# Altium schematic sheet USB.SchDoc
size A4; SheetNumber: 2; SheetTotal: 3
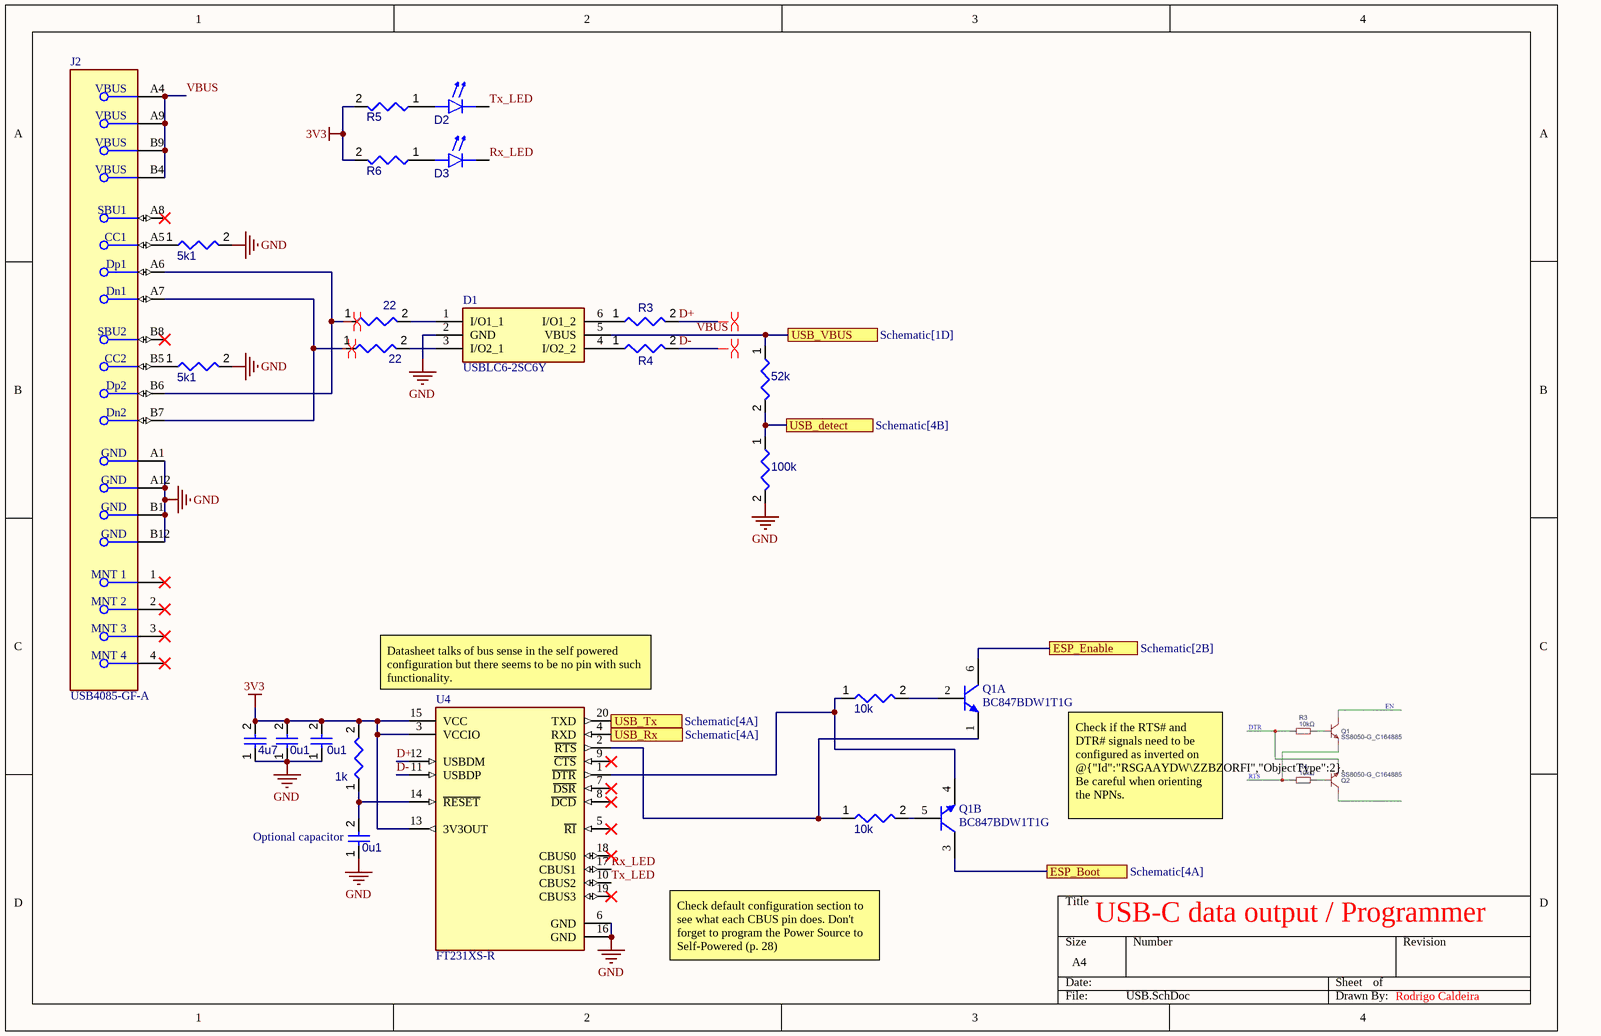
[diagram p0: USB.SchDoc]

## Parts
(Parts that share a designator on the sheet are numbered #1, #2 ... from top to bottom, then left to right.)
0u1#1  Capacitors  (value not drawn)
0u1#2  Capacitors  (value not drawn)
0u1#3  Capacitors  (value not drawn)
1k  Resistors  (value not drawn)
4u7  Capacitors  (value not drawn)
5k1#1  Resistors  (value not drawn)
5k1#2  Resistors  (value not drawn)
10k#1  Resistors  (value not drawn)
10k#2  Resistors  (value not drawn)
22#1  Resistors  (value not drawn)
22#2  Resistors  (value not drawn)
52k  Resistors  (value not drawn)
100k  Resistors  (value not drawn)
D1  USBLC6-2SC6Y  [SOT95P280X145-6N]
D2  LED  (value not drawn)
D3  LED  (value not drawn)
J2  USB4085-GF-A  [FP-USB4085-GF-A-MFG]
Q1  BC847BDW1T1G  [ONSC-SOT-363-6-419B-02_W_V]  (parts A,B of 2)
R3  Resistors  (value not drawn)
R4  Resistors  (value not drawn)
R5  Resistors  (value not drawn)
R6  Resistors  (value not drawn)
U4  FT231XS-R  [FP-SSOP-20-MFG]

## Ports
ESP_Boot (see Schematic[4A]), ESP_Enable (see Schematic[2B]), USB_detect (see Schematic[4B]), USB_Rx (see Schematic[4A]), USB_Tx (see Schematic[4A]), USB_VBUS (see Schematic[1D])

## Nets
3V3: 0u1#1.2 0u1#2.2 1k.2 4u7.2 R5.2 R6.2 U4.3(VCCIO) U4.13(3V3OUT) U4.15(VCC)
GND: 0u1#1.1 0u1#2.1 0u1#3.1 4u7.1 5k1#1.2 5k1#2.2 100k.2 D1.2(GND) J2.A1(GND) J2.A12(GND) J2.B1(GND) J2.B12(GND) U4.6(GND) U4.16(GND)
D+: R3.2 U4.12(USBDM)
D-: R4.2 U4.11(USBDP)
ESP_Boot: Q1.3(C) ; port ESP_Boot
ESP_Enable: Q1.6(C) ; port ESP_Enable
Rx_LED: D3.1(K) U4.17(CBUS1)
Tx_LED: D2.1(K) U4.10(CBUS2)
USB_detect: 52k.2 100k.1 ; port USB_detect
USB_Rx: U4.4(RXD) ; port USB_Rx
USB_Tx: U4.20(TXD) ; port USB_Tx
VBUS: 52k.1 D1.5(VBUS) J2.A4(VBUS) J2.A9(VBUS) J2.B4(VBUS) J2.B9(VBUS) ; port USB_VBUS
Net0u1#3_2: 0u1#3.2 1k.1 U4.14(~{RESET})
Net5k1#1_1: 5k1#1.1 J2.A5(CC1)
Net5k1#2_1: 5k1#2.1 J2.B5(CC2)
Net10k#1_1: 10k#1.1 Q1.4(E) U4.1(~{DTR})
Net10k#1_2: 10k#1.2 Q1.2(B)
Net10k#2_1: 10k#2.1 Q1.1(E) U4.2(~{RTS})
Net10k#2_2: 10k#2.2 Q1.5(B)
Net22#1_1: 22#1.1 J2.A6(Dp1) J2.B6(Dp2)
Net22#1_2: 22#1.2 D1.1(I/O1_1)
Net22#2_1: 22#2.1 J2.A7(Dn1) J2.B7(Dn2)
Net22#2_2: 22#2.2 D1.3(I/O2_1)
NetD1_4: D1.4(I/O2_2) R4.1
NetD1_6: D1.6(I/O1_2) R3.1
NetD2_2: D2.2(A) R5.1
NetD3_2: D3.2(A) R6.1

Not connected (* = marked no-connect by the designer): J2 1(MNT_1)* 2(MNT_2)* 3(MNT_3)* 4(MNT_4)* A8(SBU1)* B8(SBU2)*; U4 5(~{RI})* 7(~{DSR})* 8(~{DCD})* 9(~{CTS})* 18(CBUS0)* 19(CBUS3)*

## Layout directives
differential pair: D+, D-, Net22#1_1, Net22#2_1

## Notes on the sheet
- (near U4) Datasheet talks of bus sense in the self powered configuration but there seems to be no pin with such functionality.
- (near 0u1#3) Optional capacitor
- Check if the RTS# and DTR# signals need to be configured as inverted on @{"Id":"RSGAAYDW\ZZBZORFI","ObjectType":2}.
  Be careful when orienting the NPNs.
- Check default configuration section to see what each CBUS pin does. Don't forget to program the Power Source to Self-Powered (p. 28)
- USB-C data output / Programmer
- Rodrigo Caldeira

## Library data of the parts
0u1#1-0u1#3 4u7 = Capacitors: Capacitor; Component Type: Capacitors
1k 5k1#1 5k1#2 10k#1 10k#2 22#1 22#2 52k R3-R6 = Resistors: Resistor; Component Type: Resistors
D1 = USBLC6-2SC6Y: Diode; Manufacturer_Name: STMicroelectronics; Datasheet Link: https://componentsearchengine.com/Datasheets/1/USBLC6-2SC6Y.pdf; Height: 1.45mm; Manufacturer_Part_Number: USBLC6-2SC6Y; Mouser Part Number: 511-USBLC6-2SC6Y; Mouser Price/Stock: https://www.mouser.co.uk/ProductDetail/STMicroelectronics/USBLC6-2SC6Y?qs=gNDSiZmRJS%2FOgDexvXkdow%3D%3D; Arrow Part Number: USBLC6-2SC6Y; Arrow Price/Stock: https://www.arrow.com/en/products/usblc6-2sc6y/stmicroelectronics?utm_currency=USD&region=nac
D2 D3 = LED: Light-emitting Diode; Component Type: LED
J2 = CMP-196119-000001-2: CONN RCPT USB2.0 TYPE C 24POS RA; Gender: Receptacle; Number of Positions: 16; USB Standard: USB 2.0; Orientation: Right Angle; Contact Plating: Gold; Contact Material: Copper Alloy
Q1 = CMP-1048-00875-1: Dual General Purpose Transistors, NPN, 6-Pin SOT-363, Pb-Free, Tape and Reel; Manufacturer: On Semiconductor; fT Min (MHz): 100; IC Continuous (A): 0.1; Polarity: Dual NPN; ComponentLink3Description: Package Specification; PackageReference: SOT-363-6-419B-02_W; RoHS: TRUE; PackageVersion: Rev. W, 01/2006; Packing: Tape and Reel; Mounting Technology: Surface Mount; ComponentLink3URL: http://www.onsemi.com/pub_link/Collateral/NTJD4001N-D.PDF; ComponentLink2URL: http://www.onsemi.cn/pub_link/Collateral/BC846BDW1T1-D.PDF; ComponentLink2Description: Datasheet; ComponentLink1Description: Manufacturer URL; PartNumber: BC847BDW1T1G; DatasheetVersion: Rev. 9; PackageDescription: 6-Pin Small Outline Transistor, Body 2 x 1.25 mm, Pitch 0.65 mm; ComponentLink1URL: http://www.onsemi.com/
U4 = CMP-0248-00024-3: IC USB SERIAL FULL UART 20SSOP; Operating Supply Voltage: 5V; Operating Supply Current: 8mA; Number of Channels: 1; Min Supply Voltage: 2.97V; Max Supply Voltage: 5.5V; Data Rate: 12Mbps; Height: 0.059inch; Packaging: Tape and Reel; Mount: Surface Mount; Package Quantity: 2000; Radiation Hardening: No; Case/Package: SSOP; Min Operating Temperature: -40°C; Width: 0.157inch; Number of Pins: 20; Weight: 0.016oz; Interface: UART; Max Operating Temperature: 85°C; Length: 8.74mm
100k = Resistors: Component Type: Resistors